# EAGLE schematic usbshare_0.2 (EAGLE 7.7.0)
Assembly variants: optoiso, direct
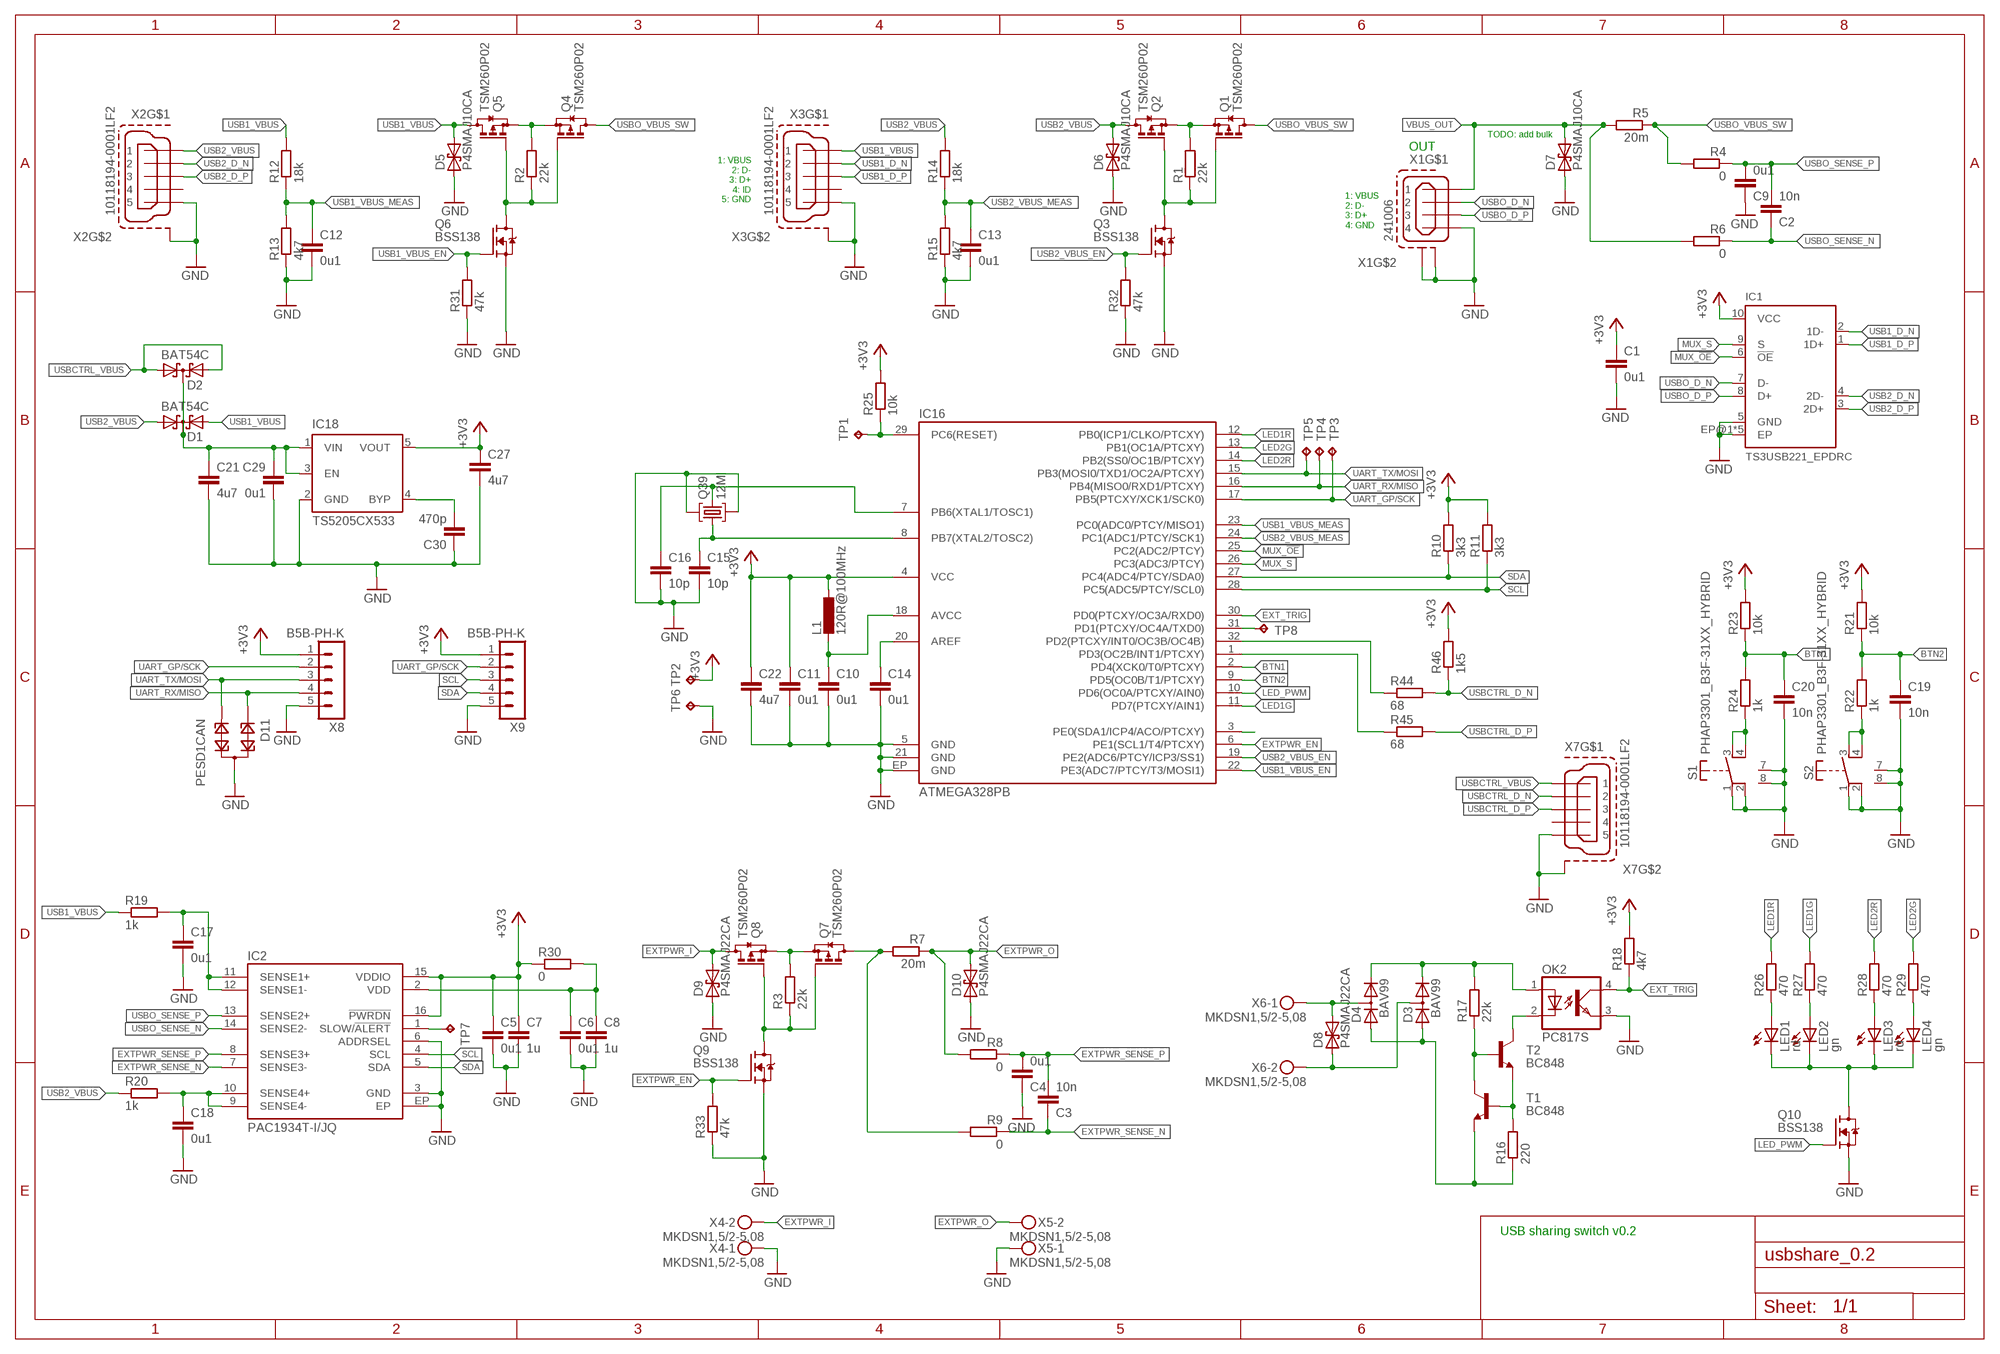
[diagram p0: schematic, sheet 1]

## Parts
C1  0u1  C-EUC0402  [C0402]
C2  10n  C-EUC0603  [C0603]
C3  10n  C-EUC0603  [C0603]
C4  0u1  C-EUC0603  [C0603]
C5  0u1  C-EUC0402  [C0402]
C6  0u1  C-EUC0402  [C0402]
C7  1u  C-EUC0603  [C0603]
C8  1u  C-EUC0603  [C0603]
C9  0u1  C-EUC0603  [C0603]
C10  0u1  C-EUC0402  [C0402]
C11  0u1  C-EUC0402  [C0402]
C12  0u1  C-EUC0603  [C0603]
C13  0u1  C-EUC0603  [C0603]
C14  0u1  C-EUC0402  [C0402]
C15  10p  C-EUC0603  [C0603]
C16  10p  C-EUC0603  [C0603]
C17  0u1  C-EUC0603  [C0603]
C18  0u1  C-EUC0603  [C0603]
C19  10n  C-EUC0603  [C0603]
C20  10n  C-EUC0603  [C0603]
C21  4u7  C-EUC0805  [C0805]
C22  4u7  C-EUC0603  [C0603]
C27  4u7  C-EUC0603  [C0603]
C29  0u1  C-EUC0603  [C0603]
C30  470p  C-EUC0603  [C0603]  (not fitted in variant optoiso)  (not fitted in variant direct)
D1  BAT54C  [SOT23]
D2  BAT54C  [SOT23]
D3  BAV99  BAV199  [SOT23]
D4  BAV99  BAV199  [SOT23]
D5  P4SMAJ10CA  [DO214AC]
D6  P4SMAJ10CA  [DO214AC]
D7  P4SMAJ10CA  [DO214AC]
D8  P4SMAJ22CA  [DO214AC]
D9  P4SMAJ22CA  [DO214AC]
D10  P4SMAJ22CA  [DO214AC]
D11  PESD1CAN  [SOT23]
IC1  TS3USB221_EPDRC  [S-PVSON-N10]
IC2  PAC1934T-I/JQ  [UQFN16]
IC16  ATMEGA328PB  [VQFN32]
IC18  TS5205CX533  [SOT23-5]
L1  120R@100MHz  L-EUL2012C  [L2012C]
LED1  rd  LEDCHIP-LED0603  [CHIP-LED0603]
LED2  gn  LEDCHIP-LED0603  [CHIP-LED0603]
LED3  rd  LEDCHIP-LED0603  [CHIP-LED0603]
LED4  gn  LEDCHIP-LED0603  [CHIP-LED0603]
OK2  PC817S  [SMD4-9]
Q1  TSM260P02  BSS84  [SOT23]
Q2  TSM260P02  BSS84  [SOT23]
Q3  BSS138  [SOT23]
Q4  TSM260P02  BSS84  [SOT23]
Q5  TSM260P02  BSS84  [SOT23]
Q6  BSS138  [SOT23]
Q7  TSM260P02  BSS84  [SOT23]
Q8  TSM260P02  BSS84  [SOT23]
Q9  BSS138  [SOT23]
Q10  BSS138  [SOT23]
Q39  12M  SMD4PADMJ  [MJ]
R1  22k  R-EU_R0603  [R0603]
R2  22k  R-EU_R0603  [R0603]
R3  22k  R-EU_R0603  [R0603]
R4  0  R-EU_R0603  [R0603]
R5  20m  R-EU_R0603  [R0603]
R6  0  R-EU_R0603  [R0603]
R7  20m  R-EU_R0603  [R0603]
R8  0  R-EU_R0603  [R0603]
R9  0  R-EU_R0603  [R0603]
R10  3k3  R-EU_R0603  [R0603]
R11  3k3  R-EU_R0603  [R0603]
R12  18k  R-EU_R0603  [R0603]
R13  4k7  R-EU_R0603  [R0603]
R14  18k  R-EU_R0603  [R0603]
R15  4k7  R-EU_R0603  [R0603]
R16  220  R-EU_R0603  [R0603]
R17  22k  R-EU_R0603  [R0603]
R18  4k7  R-EU_R0603  [R0603]
R19  1k  R-EU_R0603  [R0603]
R20  1k  R-EU_R0603  [R0603]
R21  10k  R-EU_R0603  [R0603]
R22  1k  R-EU_R0603  [R0603]
R23  10k  R-EU_R0603  [R0603]
R24  1k  R-EU_R0603  [R0603]
R25  10k  R-EU_R0603  [R0603]
R26  470  R-EU_R0603  [R0603]
R27  470  R-EU_R0603  [R0603]
R28  470  R-EU_R0603  [R0603]
R29  470  R-EU_R0603  [R0603]
R30  0  R-EU_R0603  [R0603]
R31  47k  R-EU_R0402  [R0402]
R32  47k  R-EU_R0402  [R0402]
R33  47k  R-EU_R0402  [R0402]
R44  68  R-EU_R0603  [R0603]
R45  68  R-EU_R0603  [R0603]
R46  1k5  R-EU_R0402  [R0402]
S1  PHAP3301_B3F-31XX_HYBRID  [PHAP3301_B3F-31XX_HYBRID]
S2  PHAP3301_B3F-31XX_HYBRID  [PHAP3301_B3F-31XX_HYBRID]
T1  BC848  [SOT23]
T2  BC848  [SOT23]
TP1  TPTP13R  [TP13R]
TP2  TPTP13R  [TP13R]
TP3  TPTP13R  [TP13R]
TP4  TPTP13R  [TP13R]
TP5  TPTP13R  [TP13R]
TP6  TPTP13R  [TP13R]
TP7  TPTP13R  [TP13R]
TP8  TPTP13R  [TP13R]
X1  241006  [241006]
X2  10118194-0001LF2  [10118194-0001LF_2]
X3  10118194-0001LF2  [10118194-0001LF_2]
X4  MKDSN1,5/2-5,08  [MKDSN1,5/2-5,08]
X5  MKDSN1,5/2-5,08  [MKDSN1,5/2-5,08]
X6  MKDSN1,5/2-5,08  [MKDSN1,5/2-5,08]
X7  10118194-0001LF2  [10118194-0001LF_2]
X8  B5B-PH-K  [B5B-PH-K]
X9  B5B-PH-K  [B5B-PH-K]

## Nets
+3V3: C1.1 C5.1 C7.1 C11.1 C22.1 C27.1 IC1.10(VCC) IC2.15(VDDIO) IC2.16(!PWRDN) IC16.4(VCC) IC18.5(VOUT) L1.1 R10.2 R11.2 R18.2 R21.2 R23.2 R25.2 R30.1 R46.2 TP2.TP X8.1 X9.1
AGND: D3.1(A) D4.1(A) R16.1 T1.2(E)
BTN1: C20.1 IC16.2(PD4(XCK0/T0/PTCXY)) R23.1 R24.2
BTN2: C19.1 IC16.9(PD5(OC0B/T1/PTCXY)) R21.1 R22.2
EXT_TRIG: IC16.30(PD0(PTCXY/OC3A/RXD0)) OK2.4(COL) R18.1
EXTPWR_EN: IC16.6(PE1(SCL1/T4/PTCXY)) Q9.1(G) R33.2
EXTPWR_I: D9.2 Q8.3(D) X4.2
EXTPWR_MID: Q7.3(D) R7.2 R9.2
EXTPWR_O: D10.2 R7.1 R8.2 X5.2
EXTPWR_SENSE_N [USB]: C3.1 IC2.7(SENSE3-) R9.1
EXTPWR_SENSE_P [USB]: C3.2 C4.2 IC2.8(SENSE3+) R8.1
GND: C1.2 C4.1 C5.2 C6.2 C7.2 C8.2 C9.1 C10.2 C11.2 C12.2 C13.2 C14.2 C15.2 C16.2 C17.2 C18.2 C19.2 C20.2 C21.2 C22.2 C27.2 C29.2 C30.1 D5.1 D6.1 D7.1 D9.1 D10.1 D11.3 IC1.5(GND) IC1.EP@1(EP) IC1.EP@2(EP) IC1.EP@3(EP) IC1.EP@4(EP) IC1.EP@5(EP) IC2.3(GND) IC2.6(ADDRSEL) IC2.EP IC16.5(GND) IC16.21(GND) IC16.EP(GND) IC18.2(GND) OK2.3(EMIT) Q3.2(S) Q6.2(S) Q9.2(S) Q10.2(S) Q39.2 Q39.4 R13.1 R15.1 R31.1 R32.1 R33.1 S1.1(P) S1.2(P1) S1.7(M1) S1.8(M2) S2.1(P) S2.2(P1) S2.7(M1) S2.8(M2) TP6.TP X1.4 X1.5(S1) X1.6(S2) X2.5 X2.S1 X2.S2(S1) X2.S3(S1) X2.S4(S1) X2.S5(S1) X2.S6(S1) X3.5 X3.S1 X3.S2(S1) X3.S3(S1) X3.S4(S1) X3.S5(S1) X3.S6(S1) X4.1 X5.1 X7.5 X7.S1 X7.S2(S1) X7.S3(S1) X7.S4(S1) X7.S5(S1) X7.S6(S1) X8.5 X9.5
LED1G: IC16.11(PD7(PTCXY/AIN1)) R27.2
LED1R: IC16.12(PB0(ICP1/CLKO/PTCXY)) R26.2
LED2G: IC16.13(PB1(OC1A/PTCXY)) R29.2
LED2R: IC16.14(PB2(SS0/OC1B/PTCXY)) R28.2
LED_PWM: IC16.10(PD6(OC0A/PTCXY/AIN0)) Q10.1(G)
MUX_!OE!: IC1.6(!OE) IC16.25(PC2(ADC2/PTCY))
MUX_S: IC1.9(S) IC16.26(PC3(ADC3/PTCY))
N$1: Q1.1(G) Q2.1(G) Q3.3(D) R1.1
N$2: C21.1 C29.1 D1.3(CC) D2.3(CC) IC18.1(VIN) IC18.3(EN)
N$3: Q4.2(S) Q5.2(S) R2.2
N$4: Q1.2(S) Q2.2(S) R1.2
N$5: Q4.1(G) Q5.1(G) Q6.3(D) R2.1
N$6: Q7.2(S) Q8.2(S) R3.2
N$7: Q7.1(G) Q8.1(G) Q9.3(D) R3.1
N$8: C14.1 IC16.20(AREF)
N$9: IC16.3(PE0(SDA1/ICP4/ACO/PTCXY))
N$10: R16.2 T1.1(B) T2.2(E)
N$11: LED1.C LED2.C LED3.C LED4.C Q10.3(D)
N$13: OK2.2(C) T2.3(C)
N$14: R17.1 T1.3(C) T2.1(B)
N$15: D3.2(C) D4.2(C) OK2.1(A) R17.2
N$16: D4.3(AC) D8.2 X6.1
N$17: D3.3(AC) D8.1 X6.2
N$18: C10.1 IC16.18(AVCC) L1.2
N$19: C17.1 IC2.11(SENSE1+) IC2.12(SENSE1-) R19.2
N$20: C18.1 IC2.9(SENSE4-) IC2.10(SENSE4+) R20.2
N$21: LED1.A R26.1
N$22: LED2.A R27.1
N$23: R22.1 S2.3(S) S2.4(S1)
N$24: C6.1 C8.1 IC2.2(VDD) R30.2
N$25: IC16.29(PC6(RESET)) R25.1 TP1.TP
N$26: LED3.A R28.1
N$27: R24.1 S1.3(S) S1.4(S1)
N$28: LED4.A R29.1
N$29: IC2.1(SLOW/!ALERT) TP7.TP
N$30: IC16.31(PD1(PTCXY/OC4A/TXD0)) TP8.TP
N$108: C15.1 IC16.8(PB7(XTAL2/TOSC2)) Q39.1
N$111: C16.1 IC16.7(PB6(XTAL1/TOSC1)) Q39.3
N$116: C30.2 IC18.4(BYP)
SCL: IC2.4(SCL) IC16.28(PC5(ADC5/PTCY/SCL0)) R11.1 X9.3
SDA: IC2.5(SDA) IC16.27(PC4(ADC4/PTCY/SDA0)) R10.1 X9.4
UART_GP/SCK: IC16.17(PB5(PTCXY/XCK1/SCK0)) TP3.TP X8.2 X9.2
UART_RX/MISO: D11.1 IC16.16(PB4(MISO0/RXD1/PTCXY)) TP4.TP X8.4
UART_TX/MOSI: D11.2 IC16.15(PB3(MOSI0/TXD1/OC2A/PTCXY)) TP5.TP X8.3
USB1_D_N [USB]: IC1.2(1D-) X3.2
USB1_D_P [USB]: IC1.1(1D+) X3.3
USB1_VBUS: D1.2(A2) D5.2 Q5.3(D) R12.2 R19.1 X3.1
USB1_VBUS_EN: IC16.22(PE3(ADC7/PTCY/T3/MOSI1)) Q6.1(G) R31.2
USB1_VBUS_MEAS: C12.1 IC16.23(PC0(ADC0/PTCY/MISO1)) R12.1 R13.2
USB2_D_N [USB]: IC1.4(2D-) X2.2
USB2_D_P [USB]: IC1.3(2D+) X2.3
USB2_VBUS: D1.1(A1) D6.2 Q2.3(D) R14.2 R20.1 X2.1
USB2_VBUS_EN: IC16.19(PE2(ADC6/PTCY/ICP3/SS1)) Q3.1(G) R32.2
USB2_VBUS_MEAS: C13.1 IC16.24(PC1(ADC1/PTCY/SCK1)) R14.1 R15.2
USBCTRL_D1_N [USB]: IC16.32(PD2(PTCXY/INT0/OC3B/OC4B)) R44.1
USBCTRL_D1_P [USB]: IC16.1(PD3(OC2B/INT1/PTCXY)) R45.1
USBCTRL_D_N [USB]: R44.2 R46.1 X7.2
USBCTRL_D_P [USB]: R45.2 X7.3
USBCTRL_VBUS: D2.1(A1) D2.2(A2) X7.1
USBO_D_N [USB]: IC1.7(D-) X1.2
USBO_D_P [USB]: IC1.8(D+) X1.3
USBO_SENSE_N [USB]: C2.1 IC2.14(SENSE2-) R6.1
USBO_SENSE_P [USB]: C2.2 C9.2 IC2.13(SENSE2+) R4.1
USBO_VBUS_SW: Q1.3(D) Q4.3(D) R4.2 R5.1
VBUS_OUT: D7.2 R5.2 R6.2 X1.1
Unconnected: X2.4 X3.4 X7.4

## Notes on the sheet
- TODO: add bulk
- OUT
- 1: VBUS
  2: D-
  3: D+
  4: ID
  5: GND
- 1: VBUS
  2: D-
  3: D+
  4: GND
- USB sharing switch v0.2

## Library data of the parts
C1 C5 C6 C10 C11 C14 = rcl:C-EU: CAPACITOR, European symbol
C2 C3 C19 C20 = rcl:C-EU: CAPACITOR, European symbol; OC_REICHELT: X7R-G0603 10N
C4 C9 C12 C13 C17 C18 C29 = rcl:C-EU: CAPACITOR, European symbol; OC_REICHELT: X7R-G0603 100N
C7 C8 = rcl:C-EU: CAPACITOR, European symbol; OC_REICHELT: X5R-G0603 1,0/25
C15 C16 = rcl:C-EU: CAPACITOR, European symbol; OC_REICHELT: X7R-G0603 10p
C21 = rcl:C-EU: CAPACITOR, European symbol; OC_REICHELT: KEM X5R0805 4,7U
C22 C27 = rcl:C-EU: CAPACITOR, European symbol; OC_REICHELT: KEM X5R0603 4,7U
C30 = rcl:C-EU: CAPACITOR, European symbol; OC_REICHELT: X7R-G0603 470P
D1 D2 = diode:BAT54C: Schottky Diodes Source: Fairchild .. BAT54.pdf; OC_REICHELT: BAT 54C NXP
D3 D4 = diode:BAV199: DIODE low-leakage double diode; OC_REICHELT: BAV 99 NXP
D5-D7 = diode-diotec:P4SMAJ; OC_REICHELT: P4SMAJ10CA
D8-D10 = diode-diotec:P4SMAJ; OC_REICHELT: P4SMAJ22CA
D11 = diode:PESD1CAN: CAN bus ESD protection diode Source: http://www.nxp.com/documents/data_sheet/PESD1CAN.pdf; OC_REICHELT: PESD 1CAN
IC1 = TI_usb:TS3USB221_EP
IC2 = microchip:PAC1934
IC16 = avr-7:ATMEGA328PB; OC_REICHELT: ATMEGA 328PB-MU
IC18 = taiwan-semi:TS5205; OC_REICHELT: TS 5205 CX533
L1 = rcl:L-EU: INDUCTOR, European symbol; OC_REICHELT: BLM18PG 121
LED1 LED3 = led:LED: LED OSRAM: - CHIPLED LG R971, LG N971, LY N971, LG Q971, LY Q971, LO R971, LY R971 LH N974, LH R974 LS Q976, LO Q976, LY Q976 LO Q996 - Hyper CHIPLED LW Q18S LB Q993, LB Q99A, LB R99A - SideLED LS A670, LO A670, LY A670, LG A670, LP A670 LB A673, LV A673, LT A673, LW A673 LH A674 LY A675 LS A676, LA A676, LO A676, LY A676, LW A676 LS A679, LY A679, LG A679 - Hyper Micro SIDELED® LS Y876, LA Y876, LO Y876, LY Y876 LT Y87S - SmartLED LW L88C, LW L88S LB L89C, LB L89S, LG L890 LS L89K, LO L89K, LY L89K LS L896, LA L896, LO L896, LY L896 - TOPLED LS T670, LO T670, LY T670, LG T670, LP T670 LSG T670, LSP T670, LSY T670, LOP T670, LYG T670 LG T671, LOG T671, LSG T671 LB T673, LV T673, LT T673, LW T673 LH T674 LS T676, LA T676, LO T676, LY T676, LB T676, LH T676, LSB T676, LW T676 LB T67C, LV T67C, LT T67C, LS T67K, LO T67K, LY T67K, LW E67C LS E67B, LA E67B, LO E67B, LY E67B, LB E67C, LV E67C, LT E67C LW T67C LS T679, LY T679, LG T679 LS T770, LO T770, LY T770, LG T770, LP T770 LB T773, LV T773, LT T773, LW T773 LH T774 LS E675, LA E675, LY E675, LS T675 LS T776, LA T776, LO T776, LY T776, LB T776 LHGB T686 LT T68C, LB T68C - Hyper Mini TOPLED® LB M676 - Mini TOPLED Santana® LG M470 LS M47K, LO M47K, LY M47K Source: http://www.osram.convergy.de LUXEON: - LUMILED® LXK2-PW12-R00, LXK2-PW12-S00, LXK2-PW14-U00, LXK2-PW14-V00 LXK2-PM12-R00, LXK2-PM12-S00, LXK2-PM14-U00 LXK2-PE12-Q00, LXK2-PE12-R00, LXK2-PE12-S00, LXK2-PE14-T00, LXK2-PE14-U00 LXK2-PB12-K00, LXK2-PB12-L00, LXK2-PB12-M00, LXK2-PB14-N00, LXK2-PB14-P00, LXK2-PB14-Q00 LXK2-PR12-L00, LXK2-PR12-M00, LXK2-PR14-Q00, LXK2-PR14-R00 LXK2-PD12-Q00, LXK2-PD12-R00, LXK2-PD12-S00 LXK2-PH12-R00, LXK2-PH12-S00 LXK2-PL12-P00, LXK2-PL12-Q00, LXK2-PL12-R00 Source: www.luxeon.com KINGBRIGHT: KA-3528ASYC Source: www.kingbright.com; OC_REICHELT: LED EL 0603 RT
LED2 LED4 = led:LED: LED OSRAM: - CHIPLED LG R971, LG N971, LY N971, LG Q971, LY Q971, LO R971, LY R971 LH N974, LH R974 LS Q976, LO Q976, LY Q976 LO Q996 - Hyper CHIPLED LW Q18S LB Q993, LB Q99A, LB R99A - SideLED LS A670, LO A670, LY A670, LG A670, LP A670 LB A673, LV A673, LT A673, LW A673 LH A674 LY A675 LS A676, LA A676, LO A676, LY A676, LW A676 LS A679, LY A679, LG A679 - Hyper Micro SIDELED® LS Y876, LA Y876, LO Y876, LY Y876 LT Y87S - SmartLED LW L88C, LW L88S LB L89C, LB L89S, LG L890 LS L89K, LO L89K, LY L89K LS L896, LA L896, LO L896, LY L896 - TOPLED LS T670, LO T670, LY T670, LG T670, LP T670 LSG T670, LSP T670, LSY T670, LOP T670, LYG T670 LG T671, LOG T671, LSG T671 LB T673, LV T673, LT T673, LW T673 LH T674 LS T676, LA T676, LO T676, LY T676, LB T676, LH T676, LSB T676, LW T676 LB T67C, LV T67C, LT T67C, LS T67K, LO T67K, LY T67K, LW E67C LS E67B, LA E67B, LO E67B, LY E67B, LB E67C, LV E67C, LT E67C LW T67C LS T679, LY T679, LG T679 LS T770, LO T770, LY T770, LG T770, LP T770 LB T773, LV T773, LT T773, LW T773 LH T774 LS E675, LA E675, LY E675, LS T675 LS T776, LA T776, LO T776, LY T776, LB T776 LHGB T686 LT T68C, LB T68C - Hyper Mini TOPLED® LB M676 - Mini TOPLED Santana® LG M470 LS M47K, LO M47K, LY M47K Source: http://www.osram.convergy.de LUXEON: - LUMILED® LXK2-PW12-R00, LXK2-PW12-S00, LXK2-PW14-U00, LXK2-PW14-V00 LXK2-PM12-R00, LXK2-PM12-S00, LXK2-PM14-U00 LXK2-PE12-Q00, LXK2-PE12-R00, LXK2-PE12-S00, LXK2-PE14-T00, LXK2-PE14-U00 LXK2-PB12-K00, LXK2-PB12-L00, LXK2-PB12-M00, LXK2-PB14-N00, LXK2-PB14-P00, LXK2-PB14-Q00 LXK2-PR12-L00, LXK2-PR12-M00, LXK2-PR14-Q00, LXK2-PR14-R00 LXK2-PD12-Q00, LXK2-PD12-R00, LXK2-PD12-S00 LXK2-PH12-R00, LXK2-PH12-S00 LXK2-PL12-P00, LXK2-PL12-Q00, LXK2-PL12-R00 Source: www.luxeon.com KINGBRIGHT: KA-3528ASYC Source: www.kingbright.com; OC_REICHELT: LED EL 0603 GR1
OK2 = optocoupler:PC817: SHARP OPTO COUPLER; OC_REICHELT: LTV 817S
Q1 Q2 Q4 Q5 Q7 Q8 = transistor-small-signal:BSS84: P-CHANNEL MOS FET; OC_REICHELT: TSM260P02CX
Q3 Q6 Q9 Q10 = transistor-fet:BSS138; OC_FARNELL: 9845330; OC_REICHELT: BSS 138 SMD
Q39 = crystal:SMD4PAD; OC_REICHELT: 12,000000-MJ
R1-R3 R17 = rcl:R-EU_: RESISTOR, European symbol; OC_REICHELT: RND 1550603 BY
R4 R6 R8 R9 R30 = rcl:R-EU_: RESISTOR, European symbol; OC_REICHELT: SMD-0603 0
R5 R7 = rcl:R-EU_: RESISTOR, European symbol
R10 R11 = rcl:R-EU_: RESISTOR, European symbol; OC_REICHELT: RND 0603 1 3,3K
R12 R14 = rcl:R-EU_: RESISTOR, European symbol; OC_REICHELT: RND 0603 1 18K
R13 R15 R18 = rcl:R-EU_: RESISTOR, European symbol; OC_REICHELT: RND 0603 1 4,7K
R16 = rcl:R-EU_: RESISTOR, European symbol; OC_REICHELT: RND 0603 1 220
R19 R20 R22 R24 = rcl:R-EU_: RESISTOR, European symbol; OC_REICHELT: RND 1550603 BK
R21 R23 R25 = rcl:R-EU_: RESISTOR, European symbol; OC_REICHELT: RND 0603 1 10K
R26-R29 = rcl:R-EU_: RESISTOR, European symbol; OC_REICHELT: RND 155HP03 DD
R31-R33 = rcl:R-EU_: RESISTOR, European symbol; OC_REICHELT: RND 0402 1 47K
R44 R45 = rcl:R-EU_: RESISTOR, European symbol; OC_REICHELT: RND 155HP03 EB
R46 = rcl:R-EU_: RESISTOR, European symbol; OC_REICHELT: RND 0402 1 1,5K
S1 S2 = sw-apem:PHAP3301_B3F-31XX_HYBRID; OC_REICHELT: TASTER 3305
T1 T2 = transistor:BC848: NPN TRANSISTOR; OC_REICHELT: BC 848C INF
TP1-TP8 = testpad:TP: Test pad
X1 = con-lumberg:241006; OC_REICHELT: LUM 2410-06
X2 X3 X7 = con-amp:10118194-0001LF
X4-X6 = con-phoenix-508:MKDSN1,5/2-5,08: MKDSN 1,5/ 2-5,08 Printklemme Nennstrom: 13,5 A Nennspannung: 250 V Rastermaß: 5,08 mm Polzahl: 2 Anschlussart: Schraubanschluss Montage: Löten Anschlussrichtung Leiter/Platine: 0 ° Artikelnummer: 1729128 Source: http://eshop.phoenixcontact.com .. 1729128.pdf; OC_REICHELT: AKL 101-02
X8 X9 = con-jst:B5B-PH-K; OC_REICHELT: JST PH5P ST

## Net classes
1 USB: width 0.21 mm, clearance 0.127 mm